# Altium project ESP Guage PCB.PrjPcb
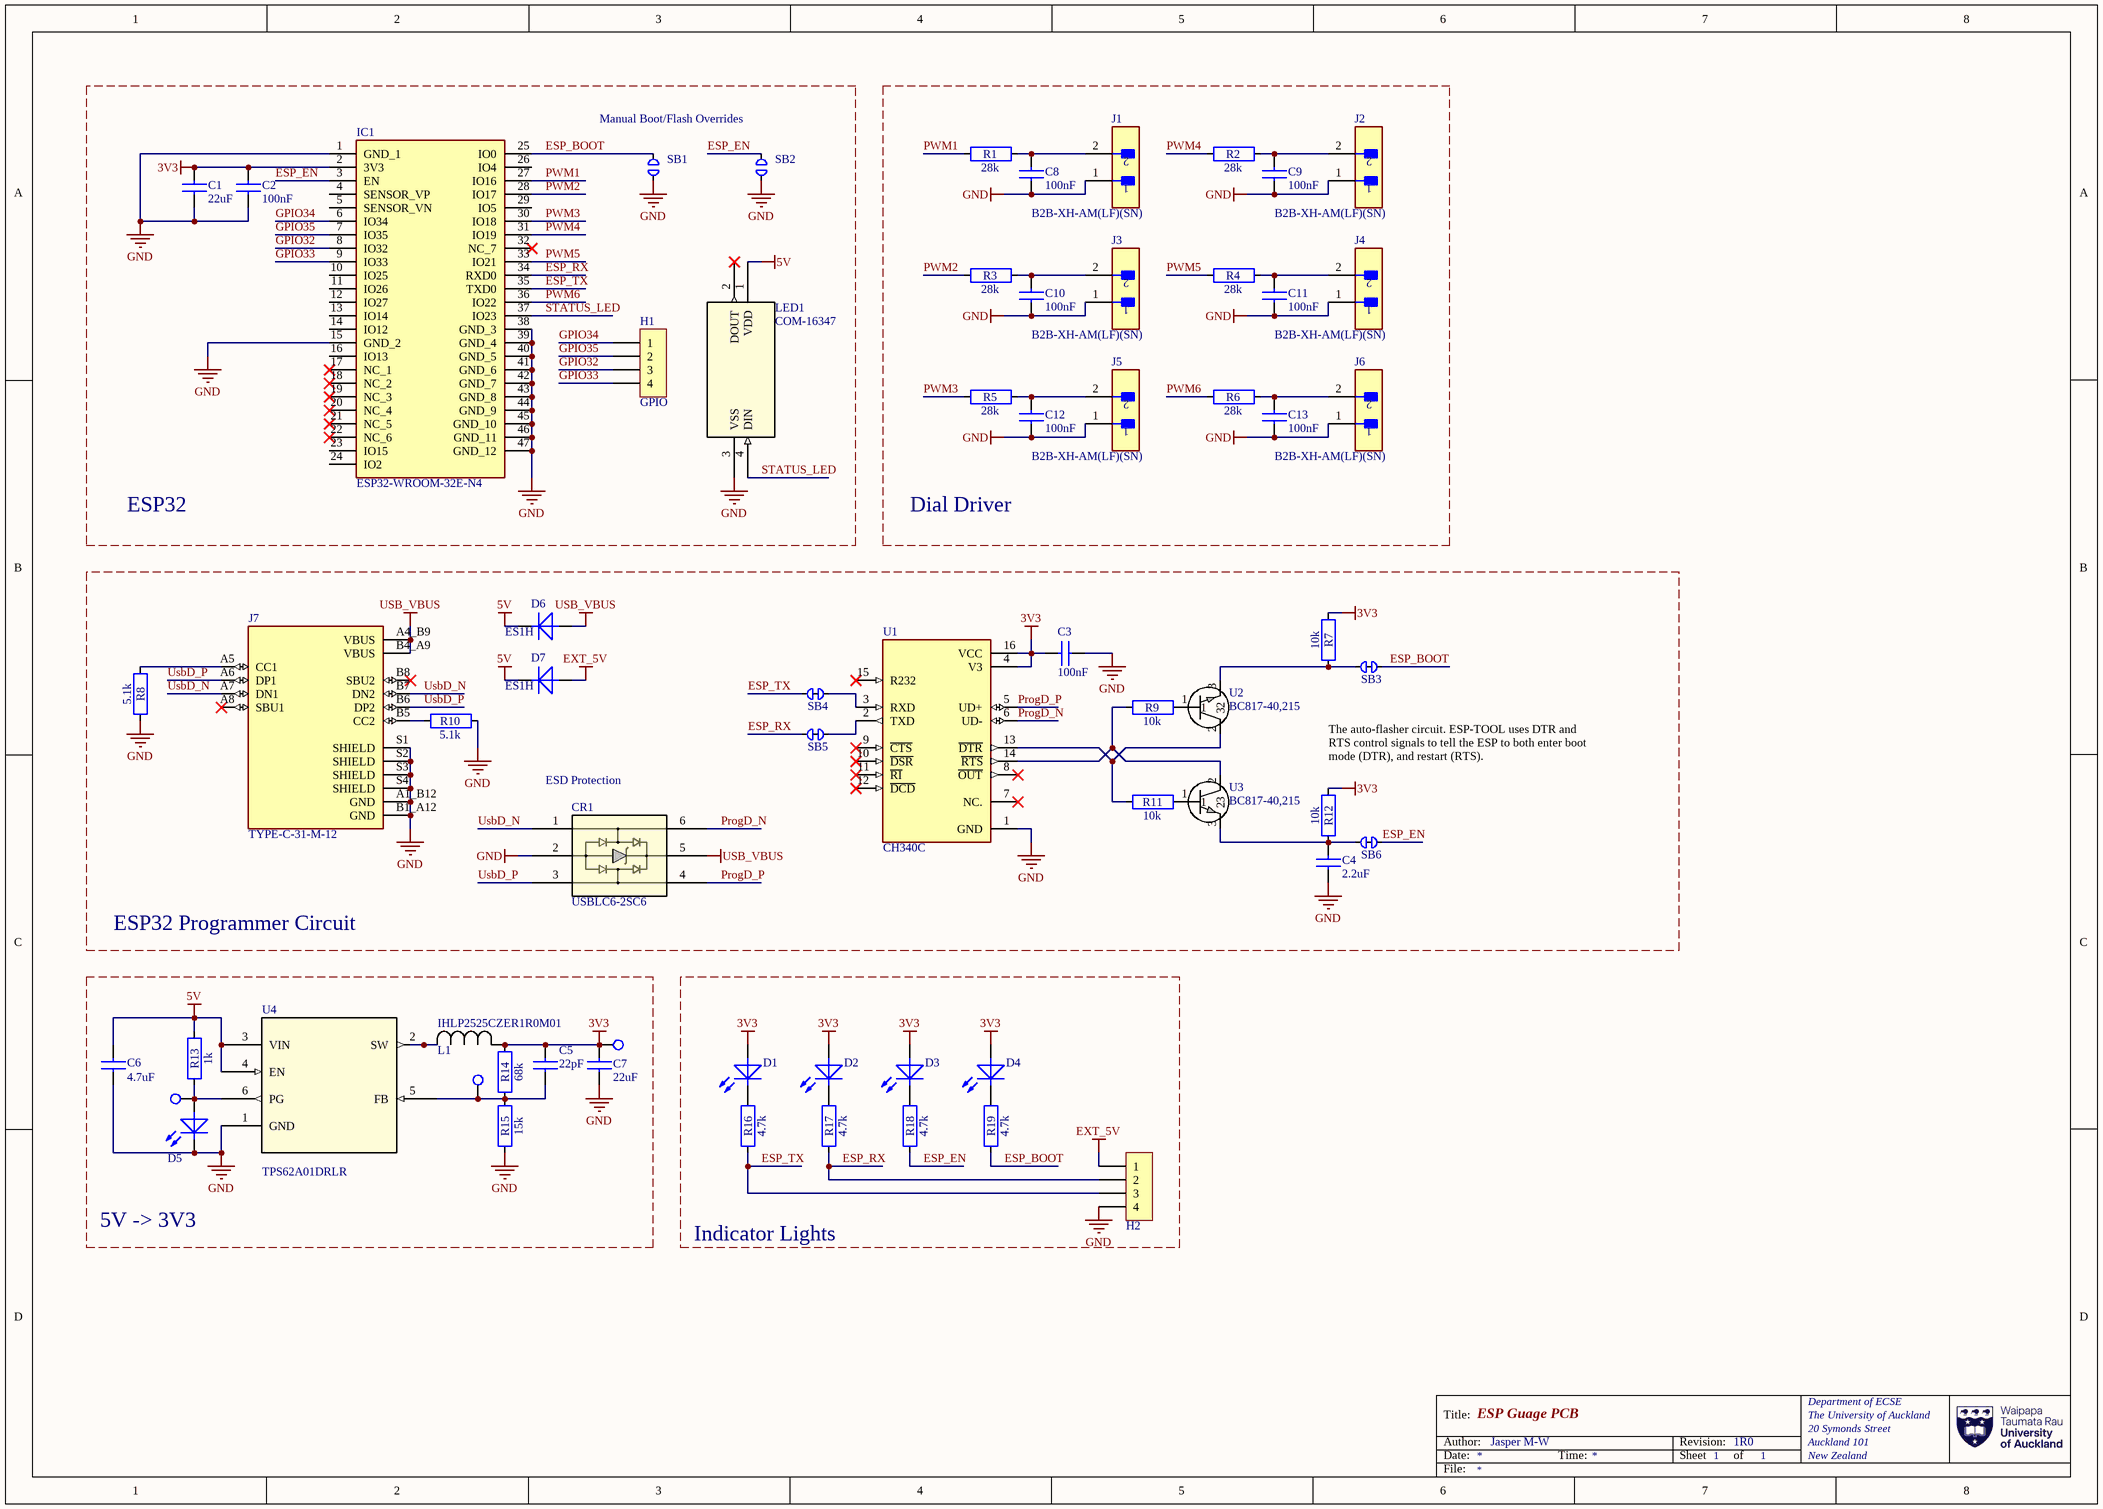
[diagram p0: ESP Guage PCB_Sch.SchDoc]
1 sheet, 65 parts. Net scope: global (net labels, ports and power ports of the same name join across sheets).
Board file: ESP Guage PCB_PCB.PcbDoc

## Sheet ESP Guage PCB_Sch.SchDoc: ESP Guage PCB
size A3; Author: Jasper M-W; CompanyName: The University of Auckland; Organization: Department of ECSE; Address1: 20 Symonds Street; Address2: Auckland 101; Address3: New Zealand; Revision: 1R0; SheetNumber: 1; SheetTotal: 1

### Parts
C1  22uF  [C0805]
C2  100nF  [C0805]
C3  100nF  [C0805]
C4  2.2uF  [C0805]
C5  22pF  [C0805]
C6  4.7uF  [C0805]
C7  22uF  [C0805]
C8  100nF  [C0805]
C9  100nF  [C0805]
C10  100nF  [C0805]
C11  100nF  [C0805]
C12  100nF  [C0805]
C13  100nF  [C0805]
CR1  USBLC6-2SC6  [SOT23-6L_STM]
D1  LED_0805  [LED_0805-Footprint-1]  (value not drawn)
D2  LED_0805  [LED_0805-Footprint-1]  (value not drawn)
D3  LED_0805  [LED_0805-Footprint-1]  (value not drawn)
D4  LED_0805  [LED_0805-Footprint-1]  (value not drawn)
D5  LED_0805  [LED_0805-Footprint-1]  (value not drawn)
D6  ES1H  [DO-214AC]
D7  ES1H  [DO-214AC]
H1  GPIO  [HEADER_2.54MM_1x4PIN]  (no BOM)
H2  1x4 Header 2.54mm  [HEADER_2.54MM_1x4PIN]  (value not drawn)  (no BOM)
IC1  ESP32-WROOM-32E-N4  [ESP32WROOM32EN4]
J1  B2B-XH-AM(LF)(SN)  [FP-B2B-XH-AM_LF_SN-MFG]
J2  B2B-XH-AM(LF)(SN)  [FP-B2B-XH-AM_LF_SN-MFG]
J3  B2B-XH-AM(LF)(SN)  [FP-B2B-XH-AM_LF_SN-MFG]
J4  B2B-XH-AM(LF)(SN)  [FP-B2B-XH-AM_LF_SN-MFG]
J5  B2B-XH-AM(LF)(SN)  [FP-B2B-XH-AM_LF_SN-MFG]
J6  B2B-XH-AM(LF)(SN)  [FP-B2B-XH-AM_LF_SN-MFG]
J7  TYPE-C-31-M-12  [HRO_TYPE-C-31-M-12]
L1  IHLP2525CZER1R0M01  [IND_IHLP-2525CZ-01_VIS]
LED1  COM-16347  [COM-16347_SPK]
R1  value 28k  [R0805]  (hidden comment: 10kj)
R2  value 28k  [R0805]  (hidden comment: 10kj)
R3  value 28k  [R0805]  (hidden comment: 10kj)
R4  value 28k  [R0805]  (hidden comment: 10kj)
R5  value 28k  [R0805]  (hidden comment: 10kj)
R6  value 28k  [R0805]  (hidden comment: 10kj)
R7  value 10k  [R0805]  (hidden comment: 10kj)
R8  value 5.1k  [R0805]  (hidden comment: 10kj)
R9  value 10k  [R0805]  (hidden comment: 10kj)
R10  value 5.1k  [R0805]  (hidden comment: 10kj)
R11  value 10k  [R0805]  (hidden comment: 10kj)
R12  value 10k  [R0805]  (hidden comment: 10kj)
R13  value 1k  [R0805]  (hidden comment: 10kj)
R14  value 68k  [R0805]  (hidden comment: 10kj)
R15  value 15k  [R0805]  (hidden comment: 10kj)
R16  value 4.7k  [R0805]  (hidden comment: 10kj)
R17  value 4.7k  [R0805]  (hidden comment: 10kj)
R18  value 4.7k  [R0805]  (hidden comment: 10kj)
R19  value 4.7k  [R0805]  (hidden comment: 10kj)
SB1  Solder Jumper Normally Open 0201  [Solder Bridge Open 0201]  (value not drawn)  (no BOM)
SB2  Solder Jumper Normally Open 0201  [Solder Bridge Open 0201]  (value not drawn)  (no BOM)
SB3  Solder Jumper Normally Closed 0201  [Solder Bridge Closed 0201]  (value not drawn)  (net tie, no BOM)
SB4  Solder Jumper Normally Closed 0201  [Solder Bridge Closed 0201]  (value not drawn)  (net tie, no BOM)
SB5  Solder Jumper Normally Closed 0201  [Solder Bridge Closed 0201]  (value not drawn)  (net tie, no BOM)
SB6  Solder Jumper Normally Closed 0201  [Solder Bridge Closed 0201]  (value not drawn)  (net tie, no BOM)
T_5  Surface Test Pad  [Test Pad]  (value not drawn)  (no BOM)
T_FB1  Surface Test Pad  [Test Pad]  (value not drawn)  (no BOM)
T_PROG1  Surface Test Pad  [Test Pad]  (value not drawn)  (no BOM)
U1  CH340C  [SOIC127P600X180-16N]
U2  BC817-40,215  [SOT23_NEX]
U3  BC817-40,215  [SOT23_NEX]
U4  TPS62A01DRLR  [SOT6_DRL_TEX]

### Blocks framed on the sheet
ESP32: C1 C2 H1 IC1 LED1 SB1 SB2
Dial Driver: C8-C13 J1-J6 R1-R6
ESP32 Programmer Circuit: C3 C4 CR1 D6 D7 J7 R7-R12 SB3-SB6 U1-U3
5V -> 3V3: C5-C7 D5 L1 R13-R15 T_5 T_FB1 T_PROG1 U4
Indicator Lights: D1-D4 H2 R16-R19

### Nets
3V3: C1.2 C2.2 C3.2 C5.2 C7.2 D1.2(A) D2.2(A) D3.2(A) D4.2(A) IC1.2(3V3) L1.2 R7.1 R12.1 R14.2 T_5.1 U1.4(V3) U1.16(VCC)
5V: C6.2 D6.1(K) D7.1(K) LED1.1(VDD) R13.2 U4.3(VIN) U4.4(EN)
EXT_5V: D7.2(A) H2.1
GND: C1.1 C2.1 C3.1 C4.1 C6.1 C7.1 C8.2 C9.2 C10.2 C11.2 C12.2 C13.2 CR1.2 D5.1(K) H2.4 IC1.1(GND_1) IC1.15(GND_2) IC1.38(GND_3) IC1.39(GND_4) IC1.40(GND_5) IC1.41(GND_6) IC1.42(GND_7) IC1.43(GND_8) IC1.44(GND_9) IC1.45(GND_10) IC1.46(GND_11) IC1.47(GND_12) J1.1 J2.1 J3.1 J4.1 J5.1 J6.1 J7.A1_B12(GND) J7.B1_A12(GND) J7.S1(SHIELD) J7.S2(SHIELD) J7.S3(SHIELD) J7.S4(SHIELD) LED1.3(VSS) R8.2 R10.2 R15.1 SB1.1 SB2.1 U1.1(GND) U4.1(GND)
USB_VBUS: CR1.5 D6.2(A) J7.A4_B9(VBUS) J7.B4_A9(VBUS)
ESP_BOOT: IC1.25(IO0) R19.1 SB1.2 SB3.1
ESP_EN: IC1.3(EN) R18.1 SB2.2 SB6.1
ESP_RX: H2.2 IC1.34(RXD0) R17.1 SB5.2
ESP_TX: H2.3 IC1.35(TXD0) R16.1 SB4.2
GPIO32: H1.3 IC1.8(IO32)
GPIO33: H1.4 IC1.9(IO33)
GPIO34: H1.1 IC1.6(IO34)
GPIO35: H1.2 IC1.7(IO35)
ProgD_N: CR1.6 U1.6(UD-)
ProgD_P: CR1.4 U1.5(UD+)
PWM1: IC1.27(IO16) R1.1
PWM2: IC1.28(IO17) R3.1
PWM3: IC1.30(IO18) R5.1
PWM4: IC1.31(IO19) R2.1
PWM5: IC1.33(IO21) R4.1
PWM6: IC1.36(IO22) R6.1
STATUS_LED: IC1.37(IO23) LED1.4(DIN)
UsbD_N: CR1.1 J7.A7(DN1) J7.B7(DN2)
UsbD_P: CR1.3 J7.A6(DP1) J7.B6(DP2)
NetC4_2: C4.2 R12.2 SB6.2 U3.3(2)
NetC5_1: C5.1 R14.1 R15.2 T_FB1.1 U4.5(FB)
NetC8_1: C8.1 J1.2 R1.2
NetC9_1: C9.1 J2.2 R2.2
NetC10_1: C10.1 J3.2 R3.2
NetC11_1: C11.1 J4.2 R4.2
NetC12_1: C12.1 J5.2 R5.2
NetC13_1: C13.1 J6.2 R6.2
NetD1_1: D1.1(K) R16.2
NetD2_1: D2.1(K) R17.2
NetD3_1: D3.1(K) R18.2
NetD4_1: D4.1(K) R19.2
NetD5_2: D5.2(A) R13.1 T_PROG1.1 U4.6(PG)
NetJ7_A5: J7.A5(CC1) R8.1
NetJ7_B5: J7.B5(CC2) R10.1
NetL1_1: L1.1 U4.2(SW)
NetR7_2: R7.2 SB3.2 U2.3(2)
NetR9_1: R9.1 U1.14(~{RTS}) U3.2(3)
NetR9_2: R9.2 U2.1
NetR11_1: R11.1 U1.13(~{DTR}) U2.2(3)
NetR11_2: R11.2 U3.1
NetSB4_1: SB4.1 U1.3(RXD)
NetSB5_1: SB5.1 U1.2(TXD)

Not connected (* = marked no-connect by the designer): IC1 4(SENSOR_VP) 5(SENSOR_VN) 10(IO25) 11(IO26) 12(IO27) 13(IO14) 14(IO12) 16(IO13) 17(NC_1)* 18(NC_2)* 19(NC_3)* 20(NC_4)* 21(NC_5)* 22(NC_6)* 23(IO15) 24(IO2) 26(IO4) 29(IO5) 32(NC_7)*; J7 A8(SBU1)* B8(SBU2)*; LED1 2(DOUT)*; U1 7(NC.)* 8(~{OUT})* 9(~{CTS})* 10(~{DSR})* 11(~{RI})* 12(~{DCD})* 15(R232)*

### Notes on the sheet
- Manual Boot/Flash Overrides
- (near CR1) ESD Protection
- (near R12) The auto-flasher circuit. ESP-TOOL uses DTR and RTS control signals to tell the ESP to both enter boot mode (DTR), and restart (RTS).
- Title:
- Author:
- Date:
- Time:
- Revision:
- Sheet
- of
- File:

### Library data of the parts
C1-C13 = CMP-00003-4: Generic 0805 cramic capacitor
  C1 C7: Value: 22uF
  C2 C3 C8-C13: Value: 100nF
  C4: Value: 2.2uF
  C5: Value: 22pF
  C6: Value: 4.7uF
CR1 = USBLC6-2SC6: ESD Protection for USB 2.0 High Speed; Manufacturer_Name: STMicroelectronics; Copyright: Copyright (C) 2025 Ultra Librarian. All rights reserved.; Manufacturer_Part_Number: USBLC6-2SC6; RefDes: RefDes; Type: Type
D1-D5 = CMP-004-00004-1: Generic SMT LED 0805
D6 D7 = CMP-004-00002-1: Rectifier Diode, 1 Phase, 1 Element, 1A, 500V V(RRM), Silicon, DO-214AC; Forward Voltage: 1.7V; Value: 8pF; Reverse Recovery Time: 35ns; Forward Current: 1A
H1 = 1x4 Header 2.54mm: JTAG
IC1 = ESP32-WROOM-32E-N4: RX TXRX MOD WIFI TRACE ANT SMD; Manufacturer_Name: Espressif Systems; Geometry.Height: 3.25mm; Datasheet Link: https://www.espressif.com/sites/default/files/documentation/esp32-wroom-32e_esp32-wroom-32ue_datasheet_en.pdf; Manufacturer_Part_Number: ESP32-WROOM-32E-N4; Mouser Part Number: 356-ESP32WRM32E132PH; Mouser Price/Stock: https://www.mouser.co.uk/ProductDetail/Espressif-Systems/ESP32-WROOM-32E-N4?qs=Li%252BoUPsLEnsPzTWsi%252BRMgQ%3D%3D
J1-J6 = CMP-17439-000037-1: CONN HEADER VERT 2POS 2.5MM; Max Voltage Rating (AC): 250V; Connector Type: Male Pin; Contact Resistance: 20mR; Max Current Rating: 3A; Number of Positions: 2; Series: XH; Contact Material: Brass; Mount: Through Hole; Housing Material: Polyamide; Contact Plating: Tin; Termination: Solder; Max Operating Temperature: 85°C; Depth: 5.75mm; Packaging: Bulk; Min Operating Temperature: -25°C; Contact Type: Male Pin; Color: Green; Pitch: 2.5mm; Length: 7.4mm; Lead Free: Lead Free; Number of Rows: 1; Fastening Type: Detent; Housing Color: White; Orientation: Straight
J7 = TYPE-C-31-M-12: USB Connectors 24 Receptacle 1 8.94*7.3mm RoHS; MF: HRO Electronics Co., Ltd.; SnapEDA_Link: https://www.snapeda.com/parts/TYPE-C-31-M-12/HRO+Electronics+Co.%252C+Ltd./view-part/?ref=snap; Package: Package; Value: *; MP: TYPE-C-31-M-12; Check_prices: https://www.snapeda.com/parts/TYPE-C-31-M-12/HRO+Electronics+Co.%252C+Ltd./view-part/?ref=eda
L1 = IHLP2525CZER1R0M01: IHLP-2525CZ-01 1 20% ER E3 1uH; Manufacturer_Name: Vishay; Copyright: Copyright (C) 2025 Ultra Librarian. All rights reserved.; Manufacturer_Part_Number: IHLP2525CZER1R0M01
LED1 = COM-16347: Description; Manufacturer_Name: Sparkfun; Type: LED Addressable; Copyright: Copyright (C) 2026 Ultra Librarian. All rights reserved.; Manufacturer_Part_Number: COM-16347; RefDes: RefDes
R1-R19 = CMP-00002-12: Generic 0805 resistor; Voltage Rating: 150V; Package: 0805
U1 = CH340C: USB to serial chip CH340; MF: WCH; Price: None; Availability: Not in stock; MP: CH340C; Package: None; SnapEDA_Link: https://www.snapeda.com/parts/CH340C/WCH/view-part/?ref=snap; Check_prices: https://www.snapeda.com/parts/CH340C/WCH/view-part/?ref=eda; Value: *
U2 U3 = BC817-40,215: Description; Manufacturer_Name: Nexperia; Copyright: Copyright (C) 2026 Ultra Librarian. All rights reserved.; Manufacturer_Part_Number: BC817-40,215
U4 = TPS62A01DRLR: 2.5V-to-5.5V input, 1A output high-efficiency step-down converter 6-SOT-5X3 -40 to 125; Manufacturer_Name: Texas Instruments; Copyright: Copyright (C) 2025 Ultra Librarian. All rights reserved.; Manufacturer_Part_Number: TPS62A01DRLR; RefDes: RefDes; Type: Type
SB1 SB2 = Solder Jumper Normally Open 0201: DEBUG: DEBUG
SB3-SB6 = Solder Jumper Normally Closed 0201: DEBUG: DEBUG